# EAGLE schematic op-synth 0.91 (EAGLE 6.6.0)
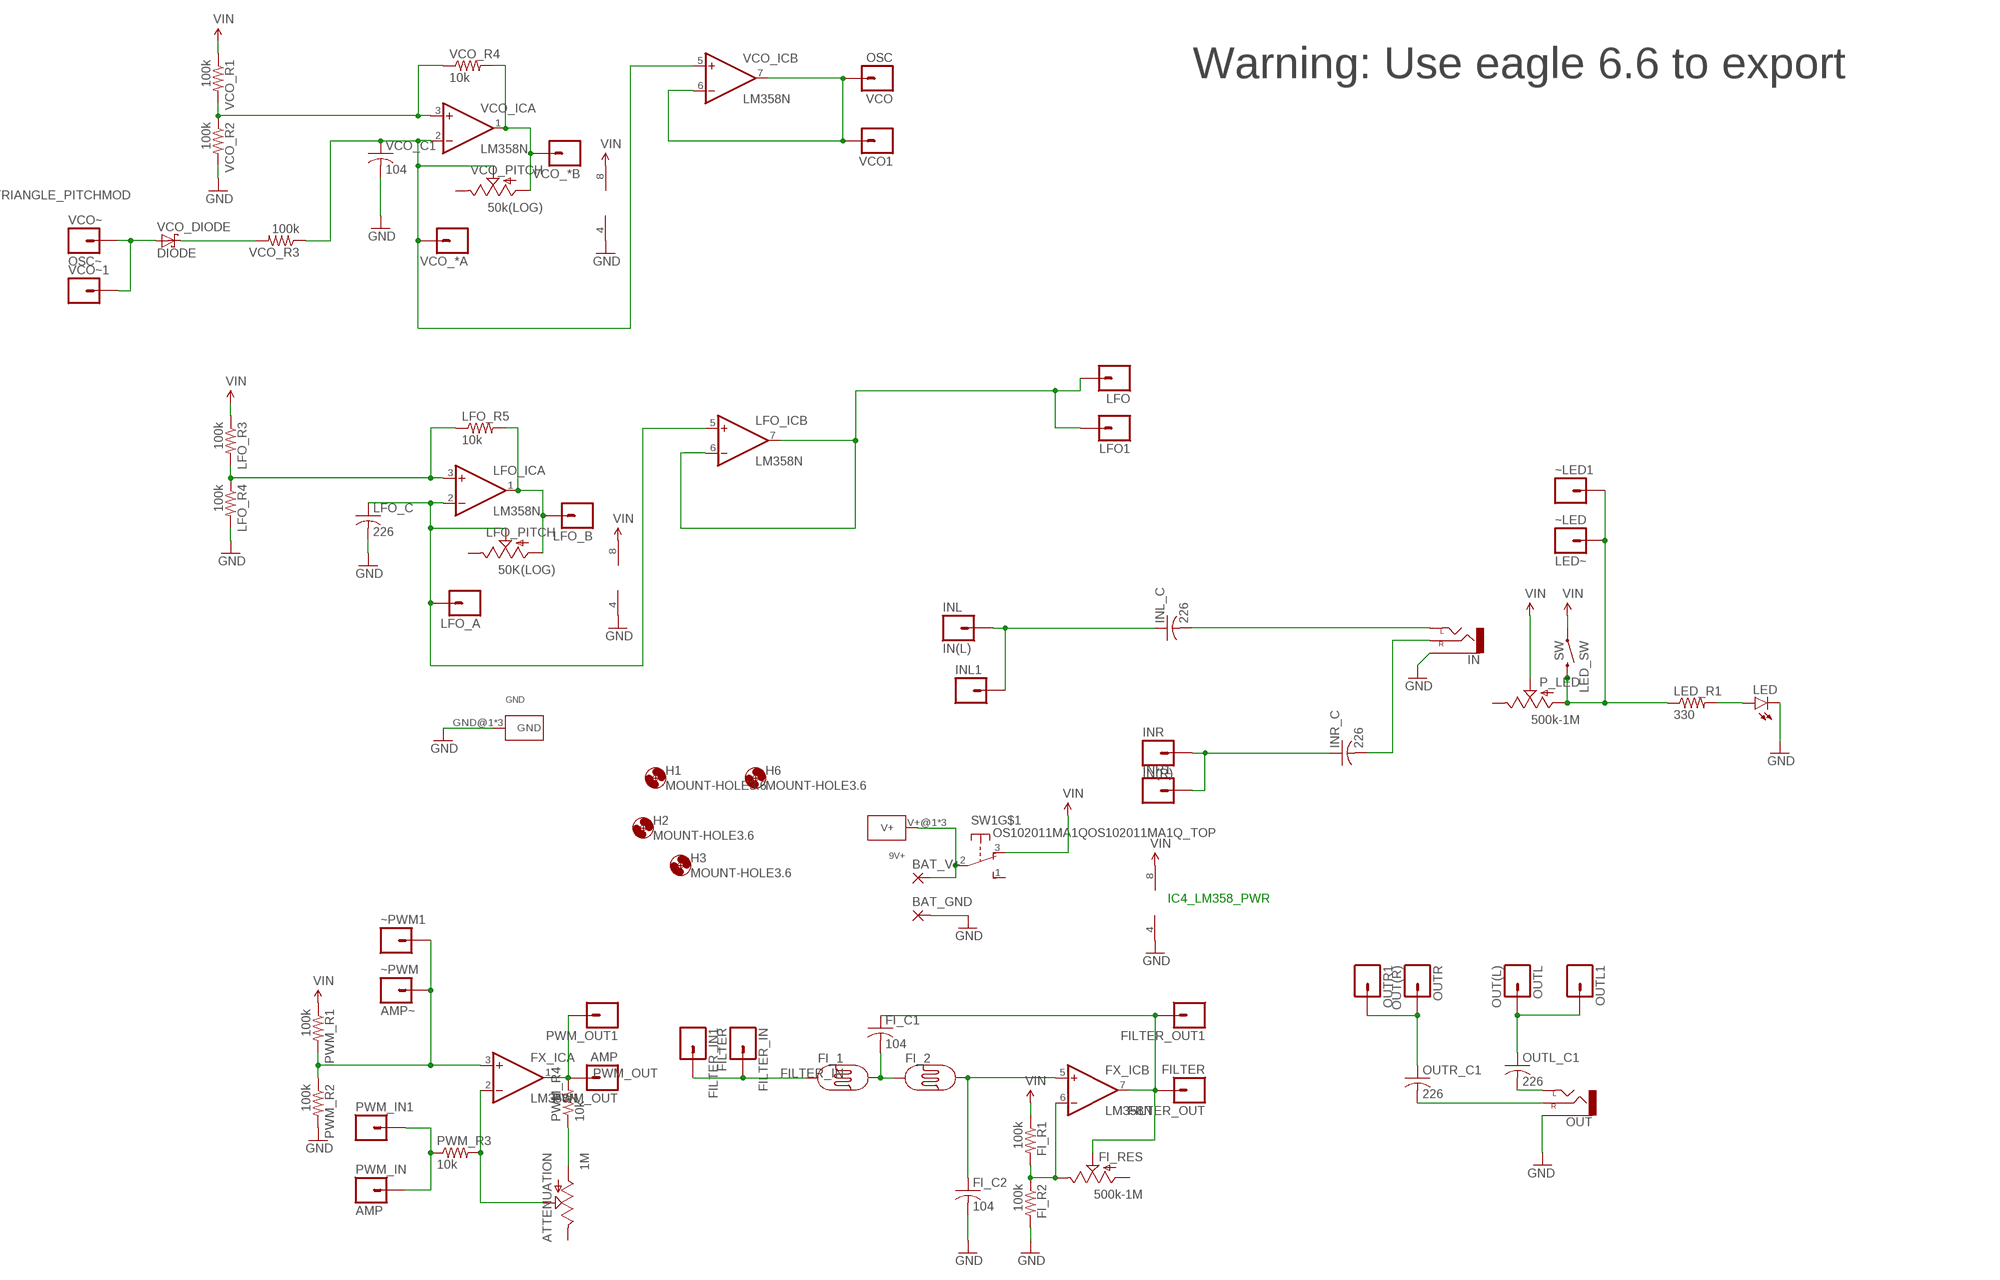
[diagram p0: schematic, sheet 1]

## Parts
9V+  KEYSTONE-629+  [KEYSTONE_BATTAERY_TERMINAL-629+]
ATTENUATION  1M  POTTRIM  [TRIM_POT]
BAT_GND  3,81/1,4  [3,81/1,4]
BAT_V+  3,81/1,4  [3,81/1,4]
FI_1  PHOTOCELLPTH  [PHOTOCELL]
FI_2  PHOTOCELLPTH  [PHOTOCELL]
FI_C1  104  C-US050-024X044  [C050-024X044]
FI_C2  104  C-US050-024X044  [C050-024X044]
FI_R1  100k  R-US_0204/7  [0204/7]
FI_R2  100k  R-US_0204/7  [0204/7]
FI_RES  500k-1M  POT  [ALPS_POT]
FILTER_IN  FILTER  HEADER-1X1  [1X01_SIDE_NAME]
FILTER_IN1  HEADER-1X1  [1X01_SIDE_NAME]
FILTER_OUT  FILTER  HEADER-1X1  [1X01_SIDE_NAME]
FILTER_OUT1  HEADER-1X1  [1X01_SIDE_NAME]
FX_IC  LM358N  [DIL08]
GND  KEYSTONE-629  [KEYSTONE_AA_AAA_BATTERY_TERMINAL-629]
H1  MOUNT-HOLE3.6  [3,6]
H2  MOUNT-HOLE3.6  [3,6]
H3  MOUNT-HOLE3.6  [3,6]
H6  MOUNT-HOLE3.6  [3,6]
IN  AUDIO-JACKPTH  [AUDIO-JACK]
INL  IN(L)  HEADER-1X1  [1X01_SIDE_NAME]
INL1  HEADER-1X1  [1X01_SIDE_NAME]
INL_C  226  C-US050-024X044  [C050-024X044]
INR  IN(R)  HEADER-1X1  [1X01_SIDE_NAME]
INR1  HEADER-1X1  [1X01_SIDE_NAME]
INR_C  226  C-US050-024X044  [C050-024X044]
LED  LED5MM  [LED5MM]
LED_R1  330  R-US_0204/7  [0204/7]
LED_SW  SW  SWITCH-MOMENTARY-212MM  [TACTILE-PTH-12MM]
LFO  HEADER-1X1  [1X01_SIDE_NAME]
LFO1  HEADER-1X1  [1X01_SIDE_NAME]
LFO_A  HEADER-1X1  [1X01_SIDE_NAME]
LFO_B  HEADER-1X1  [1X01_SIDE_NAME]
LFO_C  226  C-US050-024X044  [C050-024X044]
LFO_IC  LM358N  [DIL08]
LFO_PITCH  50K(LOG)  POT  [ALPS_POT]
LFO_R3  100k  R-US_0204/7  [0204/7]
LFO_R4  100k  R-US_0204/7  [0204/7]
LFO_R5  10k  R-US_0204/7  [0204/7]
OUT  AUDIO-JACKPTH  [AUDIO-JACK]
OUTL  OUT(L)  HEADER-1X1  [1X01_SIDE_NAME]
OUTL1  HEADER-1X1  [1X01_SIDE_NAME]
OUTL_C1  226  C-US050-024X044  [C050-024X044]
OUTR  OUT(R)  HEADER-1X1  [1X01_SIDE_NAME]
OUTR1  HEADER-1X1  [1X01_SIDE_NAME]
OUTR_C1  226  C-US050-024X044  [C050-024X044]
P_LED  500k-1M  POT  [ALPS_POT]
PWM_IN  AMP  HEADER-1X1  [1X01_SIDE_NAME]
PWM_IN1  HEADER-1X1  [1X01_SIDE_NAME]
PWM_OUT  AMP  HEADER-1X1  [1X01_SIDE_NAME]
PWM_OUT1  HEADER-1X1  [1X01_SIDE_NAME]
PWM_R1  100k  R-US_0204/7  [0204/7]
PWM_R2  100k  R-US_0204/7  [0204/7]
PWM_R3  10k  R-US_0204/7  [0204/7]
PWM_R4  10k  R-US_0204/7  [0204/7]
SW1  OS102011MA1QOS102011MA1Q_TOP  [OS102011MA1Q]
VCO  OSC  HEADER-1X1  [1X01_SIDE_NAME]
VCO1  HEADER-1X1  [1X01_SIDE_NAME]
VCO_*A  HEADER-1X1  [1X01_SIDE_NAME]
VCO_*B  HEADER-1X1  [1X01_SIDE_NAME]
VCO_C1  104  C-US050-024X044  [C050-024X044]
VCO_DIODE  DIODE  SCHOTTKY-DIODEDO41-7  [DO41-7]
VCO_IC  LM358N  [DIL08]
VCO_PITCH  50k(LOG)  POT  [ALPS_POT]
VCO_R1  100k  R-US_0204/7  [0204/7]
VCO_R2  100k  R-US_0204/7  [0204/7]
VCO_R3  100k  R-US_0204/7  [0204/7]
VCO_R4  10k  R-US_0204/7  [0204/7]
VCO~  OSC~  HEADER-1X1  [1X01_SIDE_NAME]
VCO~1  HEADER-1X1  [1X01_SIDE_NAME]
~LED  LED~  HEADER-1X1  [1X01_SIDE_NAME]
~LED1  HEADER-1X1  [1X01_SIDE_NAME]
~PWM  AMP~  HEADER-1X1  [1X01_SIDE_NAME]
~PWM1  HEADER-1X1  [1X01_SIDE_NAME]

## Nets
FILTER_IN: FI_1.1 FILTER_IN1.1 FILTER_IN.1
FILTER_OUT: FI_C1.1 FI_RES.P$2(S) FILTER_OUT1.1 FILTER_OUT.1 FX_IC.7(B:OUT)
GND: BAT_GND.1(P) FI_C2.2 FI_R2.2 FX_IC.4(P:V-) GND.GND@1(GND) GND.GND@2(GND) GND.GND@3(GND) IN.SLEEVE LED.K(C) LFO_C.2 LFO_IC.4(P:V-) LFO_R4.2 OUT.SLEEVE PWM_R2.2 VCO_C1.2 VCO_IC.4(P:V-) VCO_R2.2
LFO: LFO1.1 LFO.1 LFO_IC.6(B:-IN) LFO_IC.7(B:OUT)
MOD_IN: PWM_IN1.1 PWM_IN.1 PWM_R3.1
N$1: 9V+.V+@1(V+) 9V+.V+@2(V+) 9V+.V+@3(V+) BAT_V+.1(P) SW1.2(P)
N$2: VCO_DIODE.C VCO_R3.2
N$3: ATTENUATION.1(S) FX_IC.2(A:-IN) PWM_R3.2
N$4: VCO_IC.3(A:+IN) VCO_R1.2 VCO_R2.1 VCO_R4.1
N$5: ATTENUATION.3(A) PWM_R4.1
N$6: LED.A LED_R1.2
N$7: FI_2.2 FI_C2.1 FX_IC.5(B:+IN)
N$8: FI_1.2 FI_2.1 FI_C1.2
N$9: OUTR1.1 OUTR.1 OUTR_C1.1
N$10: VCO_*B.1 VCO_IC.1(A:OUT) VCO_PITCH.P$3(A) VCO_R4.2
N$11: OUT.TIP(LEFT) OUTL_C1.2
N$12: OUTL1.1 OUTL.1 OUTL_C1.1
N$13: LED_R1.1 LED_SW.3 P_LED.P$3(A) ~LED1.1 ~LED.1
N$14: INR1.1 INR.1 INR_C.1
N$15: IN.RING(RIGHT) INR_C.2
N$16: FI_R1.2 FI_R2.1 FI_RES.P$1(E) FX_IC.6(B:-IN)
N$17: LFO_IC.3(A:+IN) LFO_R3.2 LFO_R4.1 LFO_R5.1
N$18: VCO_*A.1 VCO_C1.1 VCO_IC.2(A:-IN) VCO_IC.5(B:+IN) VCO_PITCH.P$2(S) VCO_R3.1
N$19: INL1.1 INL.1 INL_C.1
N$20: IN.TIP(LEFT) INL_C.2
N$21: LFO_B.1 LFO_IC.1(A:OUT) LFO_PITCH.P$3(A) LFO_R5.2
N$22: LFO_A.1 LFO_C.1 LFO_IC.2(A:-IN) LFO_IC.5(B:+IN) LFO_PITCH.P$2(S)
N$23: VCO1.1 VCO.1 VCO_IC.6(B:-IN) VCO_IC.7(B:OUT)
N$24: OUT.RING(RIGHT) OUTR_C1.2
N$25: FX_IC.3(A:+IN) PWM_R1.2 PWM_R2.1 ~PWM1.1 ~PWM.1
PWM_OUT: FX_IC.1(A:OUT) PWM_OUT1.1 PWM_OUT.1 PWM_R4.2
TRIANGLE_PITCHMOD: VCO_DIODE.A VCO~1.1 VCO~.1
VIN: FI_R1.1 FX_IC.8(P:V+) LED_SW.1 LFO_IC.8(P:V+) LFO_R3.1 P_LED.P$2(S) PWM_R1.1 SW1.3(O) VCO_IC.8(P:V+) VCO_R1.1
Unconnected: ATTENUATION.2(E) FI_RES.P$3(A) LFO_PITCH.P$1(E) P_LED.P$1(E) SW1.1(S) SW1.MT1(MT) SW1.MT2(MT) VCO_PITCH.P$1(E)

## Notes on the sheet
- Warning: Use eagle 6.6 to export
- IC4_LM358_PWR

## Library data of the parts
9V+ = kanflo:KEYSTONE-629+
ATTENUATION = SparkFun-Electromechanical:POT
BAT_GND BAT_V+ = wirepad:3,81/1,4: THROUGH-HOLE PAD
FI_1 FI_2 = SparkFun-Sensors:PHOTOCELL: CdS photoresistor. This is a low cost way to detect light levels. Resistance decreases with more incoming light. SparkFun SKU: SEN-09088
FI_C1 FI_C2 LFO_C = resistor:C-US: CAPACITOR, American symbol
FI_R1 FI_R2 LED_R1 LFO_R3-LFO_R5 PWM_R1-PWM_R4 VCO_R1-VCO_R4 = resistor:R-US_: RESISTOR, American symbol
FI_RES LFO_PITCH P_LED VCO_PITCH = SparkFun-Electromechanical:POT; PROD_ID: RES-09177
FILTER_IN FILTER_IN1 FILTER_OUT FILTER_OUT1 INL INL1 INR INR1 LFO LFO1 LFO_A LFO_B OUTL OUTL1 OUTR OUTR1 PWM_IN PWM_IN1 PWM_OUT PWM_OUT1 VCO VCO1 VCO_*A VCO_*B VCO~ VCO~1 ~LED ~LED1 ~PWM ~PWM1 = TOF:HEADER-1X1: Header 1 Standard 1-pin 0.1" header. Use with straight break away headers (SKU : PRT-00116), right angle break away headers (PRT-00553), swiss pins (PRT-00743), machine pins (PRT-00117), and female headers (PRT-00115).
FX_IC LFO_IC VCO_IC = linear:LM358: OP AMP also LM158; LM258; LM2904 Source: http://cache.national.com/ds/LM/LM158.pdf
GND = kanflo:KEYSTONE-629: Keystone 629 PCB Mount Battery Contact for 1 (AA), 1 (AAA), 1 (N), Coil Spring Contact Links Data sheet <http://docs-europe.electrocomponents.com/webdocs/002e/0900766b8002ef6f.pdf> RS Online <http://se.rs-online.com/web/p/battery-holders-mounts/2050057/>
H1-H3 H6 = holes:MOUNT-HOLE: MOUNTING HOLE with drill center marker
IN OUT = SparkFun-Connectors:AUDIO-JACK: 3.5mm Audio Jack Simple 3.5mm common PCB mount audio jack. Variant PTH is our storefront SKU PRT-08032
INL_C INR_C OUTL_C1 OUTR_C1 VCO_C1 = adafruit:C-US: CAPACITOR, American symbol
LED = SparkFun-LED:LED: LEDs Standard schematic elements and footprints for 5mm, 3mm, 1206, and 0603 sized LEDs. 5mm - Spark Fun Electronics SKU : COM-00529 (and others)
LED_SW = SparkFun-Electromechanical:SWITCH-MOMENTARY-2: Various NO switches- pushbuttons, reed, etc; PROD_ID: SWCH-09185
SW1 = TOF:OS102011MA1Q: OS10201MA1Q through-hole right angle switch http://www.ladyada.net/library/eagle
VCO_DIODE = adafruit:SCHOTTKY-DIODE: Schottky Diode